# Altium schematic sheet interior_con_disparo.SchDoc
size A
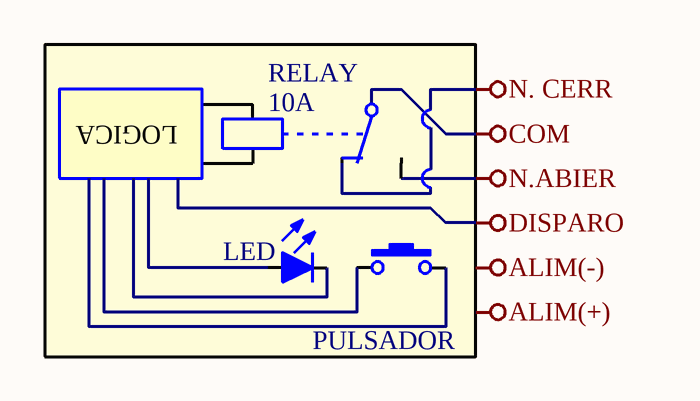
[diagram p0: interior_con_disparo.SchDoc]

## Parts
D?  LED  [3528]
K?  Codigo Elemon: 10A  Dolares Elemon: RELAY  [relay2]  (hidden comment: SRD-12VDC-SLC)
PULSADOR  Pulsador  [PULSADOR200TH]  (value not drawn)

## Blocks framed on the sheet
LOGICA: D? K? PULSADOR

## Nets
COM: K?.1

Not connected (* = marked no-connect by the designer): D? 1(A) 2(K); K? 2 3 4 5; PULSADOR 1 2

## Notes on the sheet
- Labels drawn without touching a wire or pin: ALIM(+), ALIM(-)

## Library data of the parts
D? = LED: Color: Green; Price: ?
K? = Relay 12V; 1 Inversor
PULSADOR = Pulsador: Price: ?